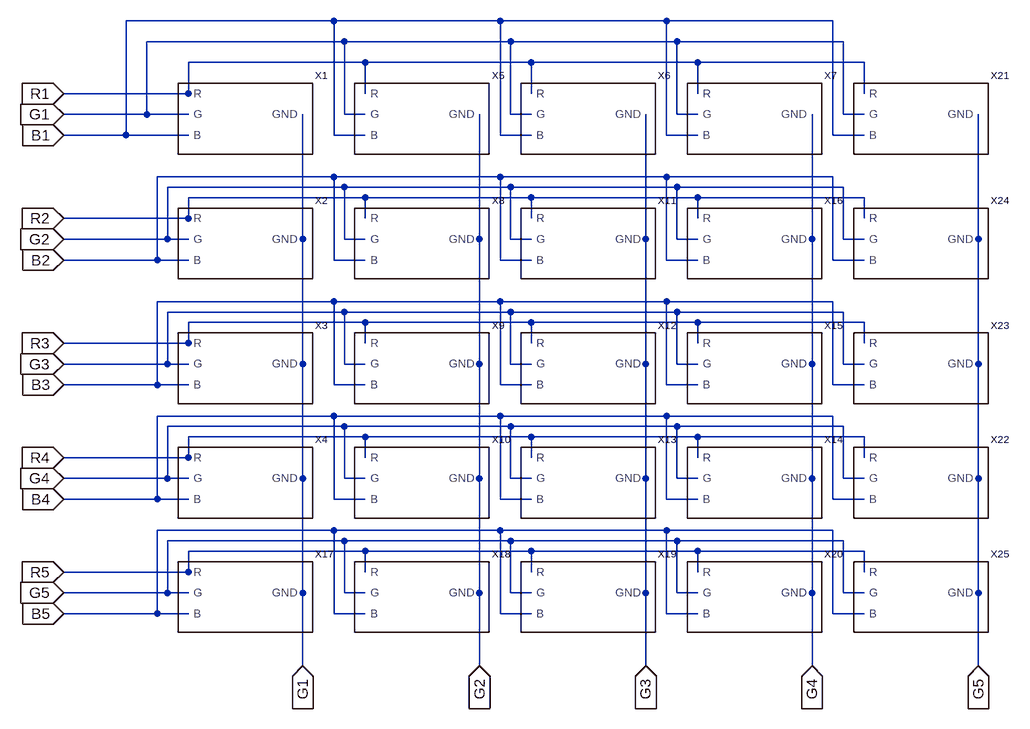
[diagram p0: schematic LED-Grid.asc]
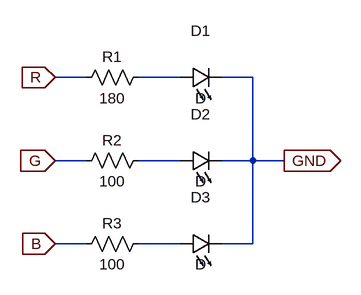
[diagram p1: sub-circuit rgb-led.asc]
LED-Grid.asc, the LTspice schematic file:
Version 4
SHEET 1 1356 1024
WIRE 288 -64 -32 -64
WIRE 544 -64 288 -64
WIRE 800 -64 544 -64
WIRE 1056 -64 800 -64
WIRE 304 -32 0 -32
WIRE 560 -32 304 -32
WIRE 816 -32 560 -32
WIRE 1072 -32 816 -32
WIRE 336 0 64 0
WIRE 592 0 336 0
WIRE 848 0 592 0
WIRE 1104 0 848 0
WIRE 64 48 64 0
WIRE 64 48 -128 48
WIRE 336 48 336 0
WIRE 592 48 592 0
WIRE 848 48 848 0
WIRE 1104 48 1104 0
WIRE 0 80 0 -32
WIRE 0 80 -128 80
WIRE 64 80 0 80
WIRE 304 80 304 -32
WIRE 336 80 304 80
WIRE 560 80 560 -32
WIRE 592 80 560 80
WIRE 816 80 816 -32
WIRE 848 80 816 80
WIRE 1072 80 1072 -32
WIRE 1104 80 1072 80
WIRE -32 112 -32 -64
WIRE -32 112 -128 112
WIRE 64 112 -32 112
WIRE 288 112 288 -64
WIRE 336 112 288 112
WIRE 544 112 544 -64
WIRE 592 112 544 112
WIRE 800 112 800 -64
WIRE 848 112 800 112
WIRE 1056 112 1056 -64
WIRE 1104 112 1056 112
WIRE 288 176 16 176
WIRE 544 176 288 176
WIRE 800 176 544 176
WIRE 1056 176 800 176
WIRE 304 192 32 192
WIRE 560 192 304 192
WIRE 816 192 560 192
WIRE 1072 192 816 192
WIRE 336 208 64 208
WIRE 592 208 336 208
WIRE 848 208 592 208
WIRE 1104 208 848 208
WIRE 64 240 64 208
WIRE 64 240 -128 240
WIRE 336 240 336 208
WIRE 592 240 592 208
WIRE 848 240 848 208
WIRE 1104 240 1104 208
WIRE 32 272 32 192
WIRE 32 272 -128 272
WIRE 64 272 32 272
WIRE 240 272 240 80
WIRE 304 272 304 192
WIRE 336 272 304 272
WIRE 512 272 512 80
WIRE 560 272 560 192
WIRE 592 272 560 272
WIRE 768 272 768 80
WIRE 816 272 816 192
WIRE 848 272 816 272
WIRE 1024 272 1024 80
WIRE 1072 272 1072 192
WIRE 1104 272 1072 272
WIRE 1280 272 1280 80
WIRE 16 304 16 176
WIRE 16 304 -128 304
WIRE 64 304 16 304
WIRE 288 304 288 176
WIRE 336 304 288 304
WIRE 544 304 544 176
WIRE 592 304 544 304
WIRE 800 304 800 176
WIRE 848 304 800 304
WIRE 1056 304 1056 176
WIRE 1104 304 1056 304
WIRE 288 368 16 368
WIRE 544 368 288 368
WIRE 800 368 544 368
WIRE 1056 368 800 368
WIRE 304 384 32 384
WIRE 560 384 304 384
WIRE 816 384 560 384
WIRE 1072 384 816 384
WIRE 336 400 64 400
WIRE 592 400 336 400
WIRE 848 400 592 400
WIRE 1104 400 848 400
WIRE 64 432 64 400
WIRE 64 432 -128 432
WIRE 336 432 336 400
WIRE 592 432 592 400
WIRE 848 432 848 400
WIRE 1104 432 1104 400
WIRE 32 464 32 384
WIRE 32 464 -128 464
WIRE 64 464 32 464
WIRE 240 464 240 272
WIRE 304 464 304 384
WIRE 336 464 304 464
WIRE 512 464 512 272
WIRE 560 464 560 384
WIRE 592 464 560 464
WIRE 768 464 768 272
WIRE 816 464 816 384
WIRE 848 464 816 464
WIRE 1024 464 1024 272
WIRE 1072 464 1072 384
WIRE 1104 464 1072 464
WIRE 1280 464 1280 272
WIRE 16 496 16 368
WIRE 16 496 -128 496
WIRE 64 496 16 496
WIRE 288 496 288 368
WIRE 336 496 288 496
WIRE 544 496 544 368
WIRE 592 496 544 496
WIRE 800 496 800 368
WIRE 848 496 800 496
WIRE 1056 496 1056 368
WIRE 1104 496 1056 496
WIRE 288 544 16 544
WIRE 544 544 288 544
WIRE 800 544 544 544
WIRE 1056 544 800 544
WIRE 304 560 32 560
WIRE 560 560 304 560
WIRE 816 560 560 560
WIRE 1072 560 816 560
WIRE 336 576 64 576
WIRE 592 576 336 576
WIRE 848 576 592 576
WIRE 1104 576 848 576
WIRE 64 608 64 576
WIRE 64 608 -128 608
WIRE 336 608 336 576
WIRE 592 608 592 576
WIRE 848 608 848 576
WIRE 1104 608 1104 576
WIRE 32 640 32 560
WIRE 32 640 -128 640
WIRE 64 640 32 640
WIRE 240 640 240 464
WIRE 304 640 304 560
WIRE 336 640 304 640
WIRE 512 640 512 464
WIRE 560 640 560 560
WIRE 592 640 560 640
WIRE 768 640 768 464
WIRE 816 640 816 560
WIRE 848 640 816 640
WIRE 1024 640 1024 464
WIRE 1072 640 1072 560
WIRE 1104 640 1072 640
WIRE 1280 640 1280 464
WIRE 16 672 16 544
WIRE 16 672 -128 672
WIRE 64 672 16 672
WIRE 288 672 288 544
WIRE 336 672 288 672
WIRE 544 672 544 544
WIRE 592 672 544 672
WIRE 800 672 800 544
WIRE 848 672 800 672
WIRE 1056 672 1056 544
WIRE 1104 672 1056 672
WIRE 288 720 16 720
WIRE 544 720 288 720
WIRE 800 720 544 720
WIRE 1056 720 800 720
WIRE 304 736 32 736
WIRE 560 736 304 736
WIRE 816 736 560 736
WIRE 1072 736 816 736
WIRE 336 752 64 752
WIRE 592 752 336 752
WIRE 848 752 592 752
WIRE 1104 752 848 752
WIRE 64 784 64 752
WIRE 64 784 -128 784
WIRE 336 784 336 752
WIRE 592 784 592 752
WIRE 848 784 848 752
WIRE 1104 784 1104 752
WIRE 32 816 32 736
WIRE 32 816 -128 816
WIRE 64 816 32 816
WIRE 240 816 240 640
WIRE 304 816 304 736
WIRE 336 816 304 816
WIRE 512 816 512 640
WIRE 560 816 560 736
WIRE 592 816 560 816
WIRE 768 816 768 640
WIRE 816 816 816 736
WIRE 848 816 816 816
WIRE 1024 816 1024 640
WIRE 1072 816 1072 736
WIRE 1104 816 1072 816
WIRE 1280 816 1280 640
WIRE 16 848 16 720
WIRE 16 848 -128 848
WIRE 64 848 16 848
WIRE 288 848 288 720
WIRE 336 848 288 848
WIRE 544 848 544 720
WIRE 592 848 544 848
WIRE 800 848 800 720
WIRE 848 848 800 848
WIRE 1056 848 1056 720
WIRE 1104 848 1056 848
WIRE 240 928 240 816
WIRE 512 928 512 816
WIRE 768 928 768 816
WIRE 1024 928 1024 816
WIRE 1280 928 1280 816
FLAG -128 48 R1
IOPIN -128 48 In
FLAG -128 80 G1
IOPIN -128 80 In
FLAG -128 112 B1
IOPIN -128 112 In
FLAG -128 240 R2
IOPIN -128 240 In
FLAG -128 272 G2
IOPIN -128 272 In
FLAG -128 304 B2
IOPIN -128 304 In
FLAG -128 432 R3
IOPIN -128 432 In
FLAG -128 464 G3
IOPIN -128 464 In
FLAG -128 496 B3
IOPIN -128 496 In
FLAG -128 608 R4
IOPIN -128 608 In
FLAG -128 640 G4
IOPIN -128 640 In
FLAG -128 672 B4
IOPIN -128 672 In
FLAG -128 784 R5
IOPIN -128 784 In
FLAG -128 816 G5
IOPIN -128 816 In
FLAG -128 848 B5
IOPIN -128 848 In
FLAG 240 928 G1
IOPIN 240 928 In
FLAG 512 928 G2
IOPIN 512 928 In
FLAG 768 928 G3
IOPIN 768 928 In
FLAG 1024 928 G4
IOPIN 1024 928 In
FLAG 1280 928 G5
IOPIN 1280 928 In
SYMBOL RGB-LED 144 80 R0
SYMATTR InstName X1
SYMBOL RGB-LED 144 272 R0
SYMATTR InstName X2
SYMBOL RGB-LED 144 464 R0
SYMATTR InstName X3
SYMBOL RGB-LED 144 640 R0
SYMATTR InstName X4
SYMBOL RGB-LED 416 80 R0
SYMATTR InstName X5
SYMBOL RGB-LED 672 80 R0
SYMATTR InstName X6
SYMBOL RGB-LED 928 80 R0
SYMATTR InstName X7
SYMBOL RGB-LED 416 272 R0
SYMATTR InstName X8
SYMBOL RGB-LED 416 464 R0
SYMATTR InstName X9
SYMBOL RGB-LED 416 640 R0
SYMATTR InstName X10
SYMBOL RGB-LED 672 272 R0
SYMATTR InstName X11
SYMBOL RGB-LED 672 464 R0
SYMATTR InstName X12
SYMBOL RGB-LED 672 640 R0
SYMATTR InstName X13
SYMBOL RGB-LED 928 640 R0
SYMATTR InstName X14
SYMBOL RGB-LED 928 464 R0
SYMATTR InstName X15
SYMBOL RGB-LED 928 272 R0
SYMATTR InstName X16
SYMBOL RGB-LED 144 816 R0
SYMATTR InstName X17
SYMBOL RGB-LED 416 816 R0
SYMATTR InstName X18
SYMBOL RGB-LED 672 816 R0
SYMATTR InstName X19
SYMBOL RGB-LED 928 816 R0
SYMATTR InstName X20
SYMBOL RGB-LED 1184 80 R0
SYMATTR InstName X21
SYMBOL RGB-LED 1184 640 R0
SYMATTR InstName X22
SYMBOL RGB-LED 1184 464 R0
SYMATTR InstName X23
SYMBOL RGB-LED 1184 272 R0
SYMATTR InstName X24
SYMBOL RGB-LED 1184 816 R0
SYMATTR InstName X25

rgb-led.asc, the sub-circuit schematic file:
Version 4
SHEET 1 880 680
WIRE -80 80 -128 80
WIRE 64 80 0 80
WIRE 176 80 128 80
WIRE -80 208 -128 208
WIRE 64 208 0 208
WIRE 176 208 176 80
WIRE 176 208 128 208
WIRE 224 208 176 208
WIRE -80 336 -128 336
WIRE 64 336 0 336
WIRE 176 336 176 208
WIRE 176 336 128 336
FLAG -128 80 R
IOPIN -128 80 In
FLAG -128 208 G
IOPIN -128 208 In
FLAG -128 336 B
IOPIN -128 336 In
FLAG 224 208 GND
IOPIN 224 208 Out
SYMBOL LED 64 96 R270
WINDOW 0 72 32 VTop 2
WINDOW 3 0 32 VBottom 2
SYMATTR InstName D1
SYMBOL LED 64 224 R270
WINDOW 0 72 32 VTop 2
WINDOW 3 0 32 VBottom 2
SYMATTR InstName D2
SYMBOL LED 64 352 R270
WINDOW 0 72 32 VTop 2
WINDOW 3 0 32 VBottom 2
SYMATTR InstName D3
SYMBOL res 16 64 R90
WINDOW 0 0 56 VBottom 2
WINDOW 3 32 56 VTop 2
SYMATTR InstName R1
SYMATTR Value 180
SYMBOL res 16 192 R90
WINDOW 0 0 56 VBottom 2
WINDOW 3 32 56 VTop 2
SYMATTR InstName R2
SYMATTR Value 100
SYMBOL res 16 320 R90
WINDOW 0 0 56 VBottom 2
WINDOW 3 32 56 VTop 2
SYMATTR InstName R3
SYMATTR Value 100

The netlist it stands for:
* LED-Grid.asc
XX1 R1 G1 B1 G1 rgb-led
XX2 R2 G2 B2 G1 rgb-led
XX3 R3 G3 B3 G1 rgb-led
XX4 R4 G4 B4 G1 rgb-led
XX5 R1 G1 B1 G2 rgb-led
XX6 R1 G1 B1 G3 rgb-led
XX7 R1 G1 B1 G4 rgb-led
XX8 R2 G2 B2 G2 rgb-led
XX9 R3 G3 B3 G2 rgb-led
XX10 R4 G4 B4 G2 rgb-led
XX11 R2 G2 B2 G3 rgb-led
XX12 R3 G3 B3 G3 rgb-led
XX13 R4 G4 B4 G3 rgb-led
XX14 R4 G4 B4 G4 rgb-led
XX15 R3 G3 B3 G4 rgb-led
XX16 R2 G2 B2 G4 rgb-led
XX17 R5 G5 B5 G1 rgb-led
XX18 R5 G5 B5 G2 rgb-led
XX19 R5 G5 B5 G3 rgb-led
XX20 R5 G5 B5 G4 rgb-led
XX21 R1 G1 B1 G5 rgb-led
XX22 R4 G4 B4 G5 rgb-led
XX23 R3 G3 B3 G5 rgb-led
XX24 R2 G2 B2 G5 rgb-led
XX25 R5 G5 B5 G5 rgb-led

* block symbol definitions
.subckt rgb-led R G B GND
D1 N001 GND D
D2 N002 GND D
D3 N003 GND D
R1 N001 R 180
R2 N002 G 100
R3 N003 B 100
.ends rgb-led

.model D D
.lib standard.dio
.backanno
.end